# Altium project 2_Smoke_detector.PrjPcb (part 5 of 6)
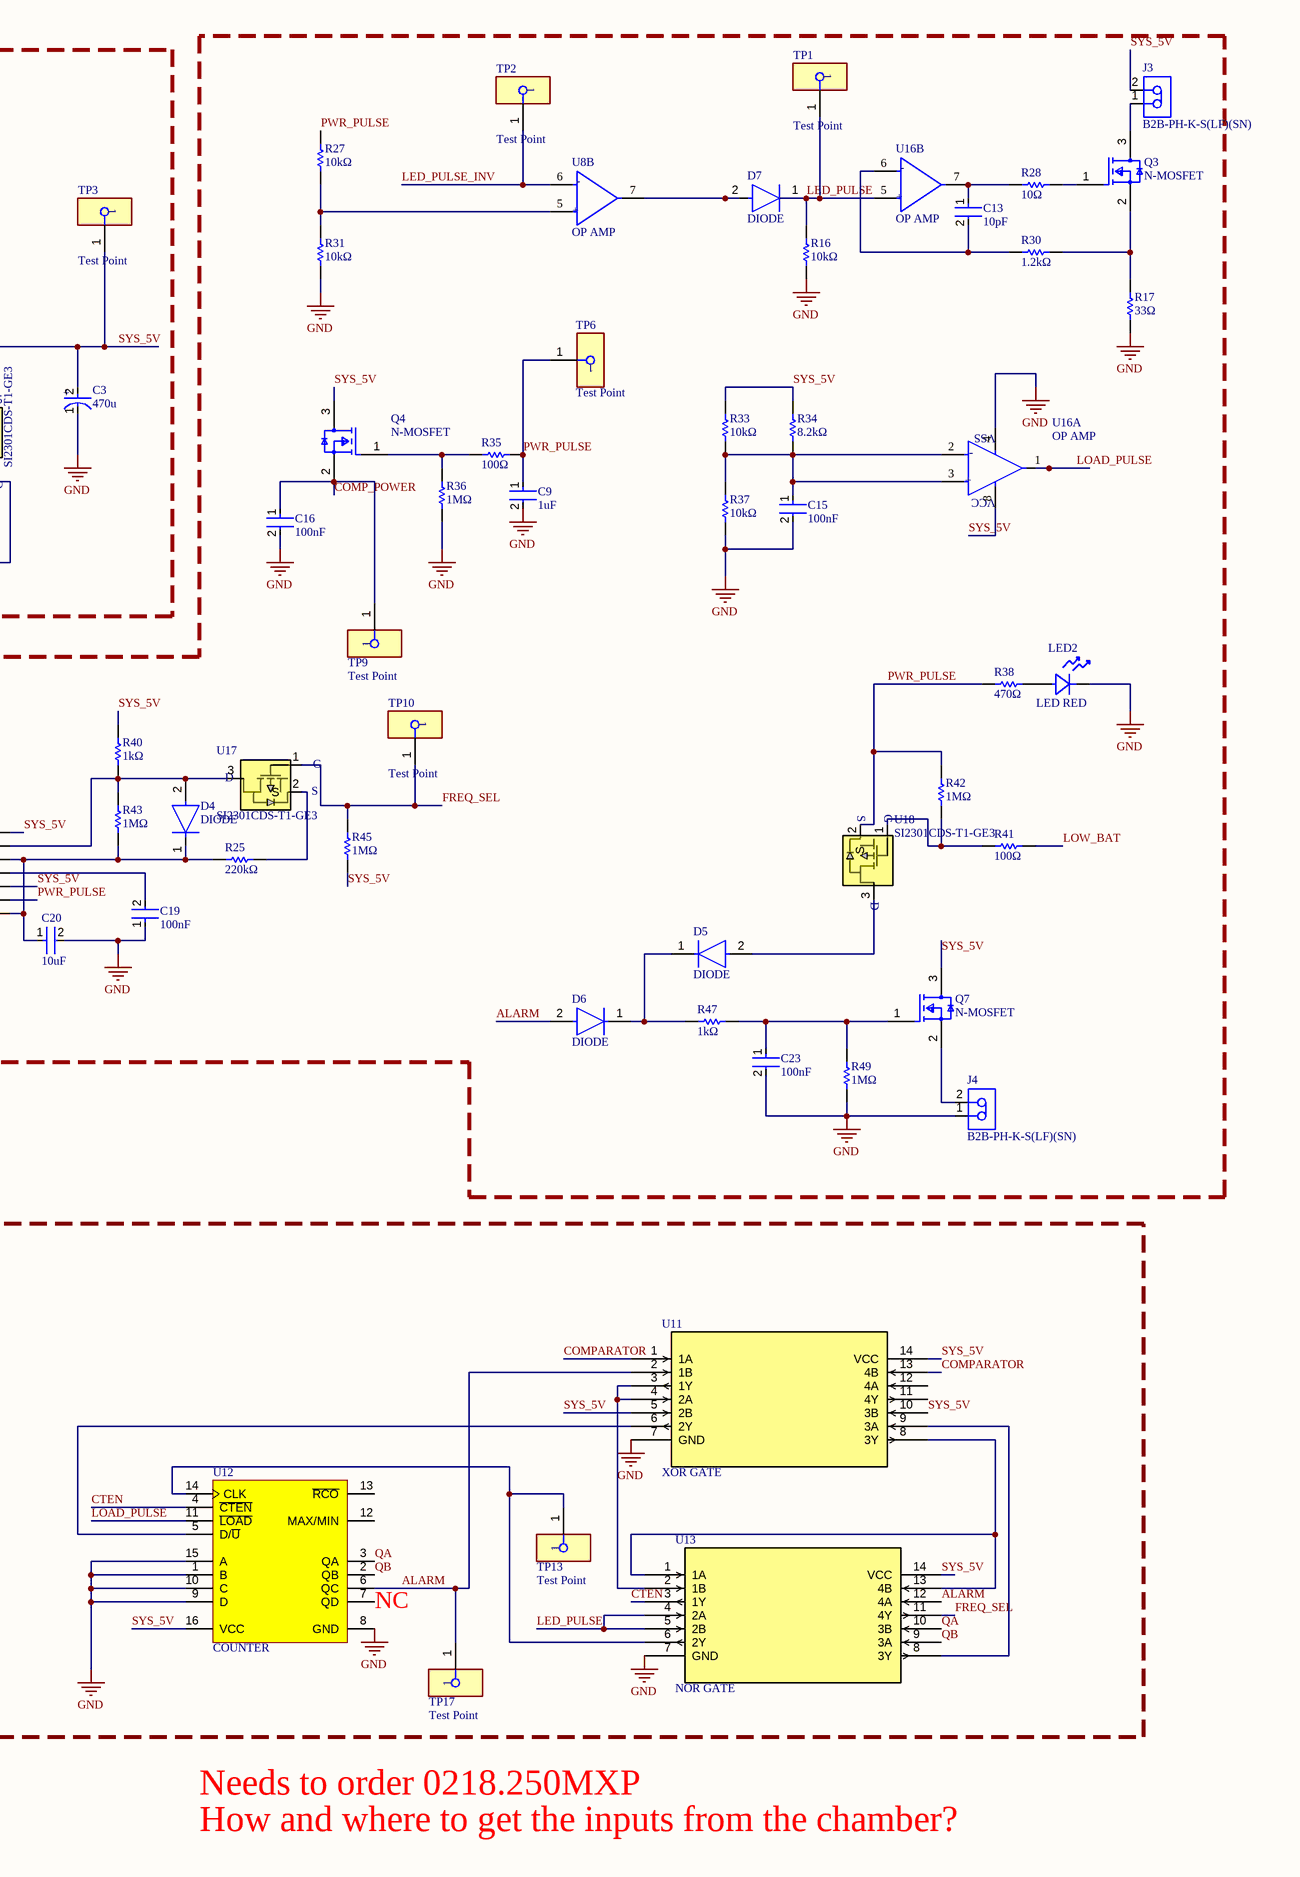
[diagram p5: 2_Smoke_detector.SchDoc, right]

## Sheet 2_Smoke_detector.SchDoc (continued)

### Library data of the parts (continued)
R23 R36 R42 R43 R45 R49 = RC0805FR-071ML: RES 1MΩ ±1% 125mW 0805; Manufacturer: Yageo Group; Temperature Coefficient: 100ppm/°C; Voltage Rating: 150V; Supplier: Future Electronics; Supplier Part Number: RC0805FR-071ML; Manufacturer Part Number: RC0805FR-071ML; RoHS: Compliant; Category: Chip SMD Resistors; Stock: 645000; Pricing: 5000=0.0068, 20000=0.0065, 75000=0.0063, 150000=0.0062, 375000=0.006 (USD); Case/Package: 0805; Case Code (Imperial): 0805; China RoHS: Non-Compliant; Composition: Thick Film; Contact Plating: Tin; Country of Origin: Mainland China, Taiwan; Depth: 1.25mm; Export Control Classification Number (ECCN) Code: EAR99; Features: Moisture Resistant; Height: 500µm; Harmonized Tariff Schedule (HTS) Code: 8533.21.00.30; Introduction Date: 2004-09-22; Lead Free: Lead Free; Length: 2mm; Lifecycle Status: Production; Max Operating Temperature: 155°C; Max Power Dissipation: 125mW; Military Standard: Not; Min Operating Temperature: -55°C; Mounting Technology: Surface Mount; Pins: 2; Number of Terminals: 2; Number of Terminations: 2; Packaging: Tape & Reel; Power Rating: 125mW; Radiation Hardening: No; REACH SVHC: Unaffected; Value: 1MΩ; Schedule B: 8533210045, 8533210045|8533210045, 8533210045|8533210045|8533210045, 8533210045|8533210045|8533210045|8533210045; Termination: SMD/SMT; Tolerance: 1%; Voltage Rating (AC): 150V; Voltage Rating (DC): 150V; Width: 1.25mm; Working Voltage: 150V; ComponentLink1URL: https://datasheet.octopart.com:443/RC0805FR-071ML-Yageo-datasheet-175887523.pdf?src-supplier=IHS; ComponentLink1Description: https://datasheet.octopart.com:443/RC0805FR-071ML-Yageo-datasheet-175887523.pdf?src-supplier=IHS; ComponentLink2URL: https://datasheet.octopart.com:443/RC0805FR-071ML-Yageo-datasheet-103092701.pdf?src-supplier=Upverter; ComponentLink2Description: https://datasheet.octopart.com:443/RC0805FR-071ML-Yageo-datasheet-103092701.pdf?src-supplier=Upverter; ComponentLink3URL: https://datasheet.octopart.com:443/RC0805FR-071ML-Yageo-datasheet-79472498.pdf?src-supplier=Upverter; ComponentLink3Description: https://datasheet.octopart.com:443/RC0805FR-071ML-Yageo-datasheet-79472498.pdf?src-supplier=Upverter; ComponentLink4URL: https://datasheet.octopart.com:443/RC0805FR-071ML-Yageo-datasheet-8330313.pdf?src-supplier=element14+APAC; ComponentLink4Description: https://datasheet.octopart.com:443/RC0805FR-071ML-Yageo-datasheet-8330313.pdf?src-supplier=element14+APAC; ComponentLink5URL: https://datasheet.octopart.com:443/RC0805FR-071ML-Yageo-Group-datasheet-190305687.pdf?src-supplier=Future+Electronics; ComponentLink5Description: https://datasheet.octopart.com:443/RC0805FR-071ML-Yageo-Group-datasheet-190305687.pdf?src-supplier=Future+Electronics; ComponentLink6URL: https://datasheet.octopart.com:443/RC0805FR-071ML-Yageo-datasheet-164759695.pdf?src-supplier=Future+Electronics; ComponentLink6Description: https://datasheet.octopart.com:443/RC0805FR-071ML-Yageo-datasheet-164759695.pdf?src-supplier=Future+Electronics; ComponentLink7URL: https://datasheet.octopart.com:443/RC0805FR-071ML-Yageo-datasheet-127823281.pdf?src-supplier=Future+Electronics; ComponentLink7Description: https://datasheet.octopart.com:443/RC0805FR-071ML-Yageo-datasheet-127823281.pdf?src-supplier=Future+Electronics; ComponentLink8URL: https://datasheet.octopart.com:443/RC0805FR-071ML-Yageo-datasheet-137700087.pdf?src-supplier=Future+Electronics; ComponentLink8Description: https://datasheet.octopart.com:443/RC0805FR-071ML-Yageo-datasheet-137700087.pdf?src-supplier=Future+Electronics; ComponentLink9URL: https://datasheet.octopart.com:443/RC0805FR-071ML-Yageo-datasheet-12592811.pdf?src-supplier=Future+Electronics; ComponentLink9Description: https://datasheet.octopart.com:443/RC0805FR-071ML-Yageo-datasheet-12592811.pdf?src-supplier=Future+Electronics; ComponentLink10URL: https://datasheet.octopart.com:443/RC0805FR-071ML-Yageo-datasheet-8324252.pdf?src-supplier=Future+Electronics; ComponentLink10Description: https://datasheet.octopart.com:443/RC0805FR-071ML-Yageo-datasheet-8324252.pdf?src-supplier=Future+Electronics; ComponentLink11URL: https://datasheet.octopart.com:443/RC0805FR-071ML-Yageo-datasheet-62067350.pdf?src-supplier=Farnell; ComponentLink11Description: https://datasheet.octopart.com:443/RC0805FR-071ML-Yageo-datasheet-62067350.pdf?src-supplier=Farnell; ComponentLink12URL: https://datasheet.octopart.com:443/RC0805FR-071ML-Yageo-datasheet-13691069.pdf?src-supplier=Farnell; ComponentLink12Description: https://datasheet.octopart.com:443/RC0805FR-071ML-Yageo-datasheet-13691069.pdf?src-supplier=Farnell; ComponentLink13URL: https://datasheet.octopart.com/RC0805FR-071ML-Yageo-datasheet-73766026.pdf; ComponentLink13Description: https://datasheet.octopart.com/RC0805FR-071ML-Yageo-datasheet-73766026.pdf; ComponentLink14URL: https://datasheet.octopart.com:443/RC0805FR-071ML-Yageo-datasheet-118657.pdf?src-supplier=DigiKey; ComponentLink14Description: https://datasheet.octopart.com:443/RC0805FR-071ML-Yageo-datasheet-118657.pdf?src-supplier=DigiKey; ComponentLink15URL: https://datasheet.octopart.com:443/RC0805FR-071ML-Yageo-datasheet-502840.pdf?src-supplier=element14; ComponentLink15Description: https://datasheet.octopart.com:443/RC0805FR-071ML-Yageo-datasheet-502840.pdf?src-supplier=element14; ComponentLink16URL: http://sigma.octopart.com:80/conflict_mineral_statement/Yageo-company-3.pdf?src-supplier=Compliance+Statements; ComponentLink16Description: http://sigma.octopart.com:80/conflict_mineral_statement/Yageo-company-3.pdf?src-supplier=Compliance+Statements; ComponentLink17URL: http://sigma.octopart.com:80/rohs_statement/Yageo-company-2.pdf?src-supplier=Compliance+Statements; ComponentLink17Description: http://sigma.octopart.com:80/rohs_statement/Yageo-company-2.pdf?src-supplier=Compliance+Statements; LCSC: C107700; LCSC Part Number: C107700
R25 = FRC0805F2203TS: RES 220kΩ ±1% 125mW 0805; LCSC Part Number: C2907242; Value: 220kΩ
R26 = CRCW080522K0FKEAC: RES 22kΩ 1% 1/8W 0805; Manufacturer: Vishay; Power Rating: 125mW; Temperature Coefficient: 100ppm/°C; Working Voltage: 150V; Supplier: Avnet; Supplier Part Number: CRCW080522K0FKEAC; Manufacturer Part Number: CRCW080522K0FKEAC; RoHS: Compliant; Category: Chip SMD Resistors; Stock: 85000; Pricing: 5000=0.00893, 100000=0.00478, 200000=0.00475, 400000=0.00473, 800000=0.0047 (USD); Case/Package: 0805; China RoHS: Non-Compliant; Composition: Thick Film; Contact Plating: Tin; Height: 500µm; Lead Free: Lead Free; Length: 2mm; Lifecycle Status: Production; Max Operating Temperature: 155°C; Min Operating Temperature: -55°C; Mounting Technology: Surface Mount; Number of Terminals: 2; REACH SVHC: Unaffected; Value: 22kΩ; Schedule B: 8533210045, 8533210045|8533210045|8533210045|8533210045|8533210045; Termination: Wraparound; Tolerance: 1%; Width: 1.25mm; ComponentLink1URL: https://datasheet.octopart.com:443/CRCW080522K0FKEAC-Vishay-datasheet-175423585.pdf?src-supplier=IHS; ComponentLink1Description: https://datasheet.octopart.com:443/CRCW080522K0FKEAC-Vishay-datasheet-175423585.pdf?src-supplier=IHS; ComponentLink2URL: https://datasheet.octopart.com:443/CRCW080522K0FKEAC-Vishay-datasheet-102570912.pdf?src-supplier=LCSC; ComponentLink2Description: https://datasheet.octopart.com:443/CRCW080522K0FKEAC-Vishay-datasheet-102570912.pdf?src-supplier=LCSC; ComponentLink3URL: https://datasheet.octopart.com:443/CRCW080522K0FKEAC-Vishay-datasheet-62316122.pdf?src-supplier=Future+Electronics; ComponentLink3Description: https://datasheet.octopart.com:443/CRCW080522K0FKEAC-Vishay-datasheet-62316122.pdf?src-supplier=Future+Electronics; ComponentLink4URL: http://sigma.octopart.com:80/rohs_statement/Vishay-company-15.pdf?src-supplier=Compliance+Statements; ComponentLink4Description: http://sigma.octopart.com:80/rohs_statement/Vishay-company-15.pdf?src-supplier=Compliance+Statements; LCSC Part Number: C844401
R28 = CRCW080510R0FKEA: RES 10Ω ±1% 125mW 0805; Manufacturer: Vishay; Manufacturer Package Identifier: CRCW0805-e3; Temperature Coefficient: 100ppm/°C; Voltage Rating: 150V; Supplier: Future Electronics; Supplier Part Number: CRCW080510R0FKEA; Manufacturer Part Number: CRCW080510R0FKEA; RoHS: Compliant; Category: Chip SMD Resistors; Stock: 2860000; Pricing: 10000=0.0023, 50000=0.0022, 125000=0.0022, 375000=0.0021, 750000=0.002 (USD); Case/Package: 0805; Case Code (Imperial): 0805; China RoHS: Non-Compliant; Composition: Thick Film; Contact Plating: Lead, Tin; Country of Origin: Israel; Depth: 1.25mm; Export Control Classification Number (ECCN) Code: EAR99; Features: Automotive AEC-Q200; Height: 450µm; Harmonized Tariff Schedule (HTS) Code: 8533.21.00.30; Introduction Date: 2005-02-16; Lead Free: Lead Free; Length: 2mm; Lifecycle Status: Production; Max Operating Temperature: 155°C; Max Power Dissipation: 125mW; Military Standard: Not; Min Operating Temperature: -55°C; Mounting Technology: Surface Mount; Pins: 2; Number of Terminals: 2; Number of Terminations: 2; Packaging: Cut Tape; Power Rating: 125mW; Radiation Hardening: No; Ratings: AEC-Q200; REACH SVHC: Unaffected; Value: 10Ω; Schedule B: 8533210045, 8533210045|8533210045|8533210045|8533210045|8533210045|8533210045|8533210045|8533210045|8533210045|8533210045|8533210045|8533210045|8533210045|8533210045|8533210045|8533210045|8533210045|8533210045|8533210045|8533210045|8533210045|8533210045|8533210045|85; Termination: SMD/SMT; Tolerance: 1%; Voltage Rating (DC): 150V; Weight: 5.499807mg; Width: 1.25mm; Working Voltage: 150V; ComponentLink1URL: https://datasheet.octopart.com:443/CRCW080510R0FKEA-Vishay-datasheet-175423584.pdf?src-supplier=IHS; ComponentLink1Description: https://datasheet.octopart.com:443/CRCW080510R0FKEA-Vishay-datasheet-175423584.pdf?src-supplier=IHS; ComponentLink2URL: https://datasheet.octopart.com:443/CRCW080510R0FKEA-Vishay-datasheet-83961561.pdf?src-supplier=Newark; ComponentLink2Description: https://datasheet.octopart.com:443/CRCW080510R0FKEA-Vishay-datasheet-83961561.pdf?src-supplier=Newark; ComponentLink3URL: https://datasheet.octopart.com:443/CRCW080510R0FKEA-Vishay-datasheet-11516975.pdf?src-supplier=Newark; ComponentLink3Description: https://datasheet.octopart.com:443/CRCW080510R0FKEA-Vishay-datasheet-11516975.pdf?src-supplier=Newark; ComponentLink4URL: https://datasheet.octopart.com:443/CRCW080510R0FKEA-Vishay-datasheet-41302739.pdf?src-supplier=Newark; ComponentLink4Description: https://datasheet.octopart.com:443/CRCW080510R0FKEA-Vishay-datasheet-41302739.pdf?src-supplier=Newark; ComponentLink5URL: https://datasheet.octopart.com:443/CRCW080510R0FKEA-Vishay-datasheet-33013972.pdf?src-supplier=Newark; ComponentLink5Description: https://datasheet.octopart.com:443/CRCW080510R0FKEA-Vishay-datasheet-33013972.pdf?src-supplier=Newark; ComponentLink6URL: https://datasheet.octopart.com:443/CRCW080510R0FKEA-Vishay-datasheet-62317937.pdf?src-supplier=element14+APAC; ComponentLink6Description: https://datasheet.octopart.com:443/CRCW080510R0FKEA-Vishay-datasheet-62317937.pdf?src-supplier=element14+APAC; ComponentLink7URL: https://datasheet.octopart.com:443/CRCW080510R0FKEA-Vishay-datasheet-14722531.pdf?src-supplier=element14+APAC; ComponentLink7Description: https://datasheet.octopart.com:443/CRCW080510R0FKEA-Vishay-datasheet-14722531.pdf?src-supplier=element14+APAC; ComponentLink8URL: https://datasheet.octopart.com:443/CRCW080510R0FKEA.-Vishay-datasheet-78776209.pdf?src-supplier=element14+APAC; ComponentLink8Description: https://datasheet.octopart.com:443/CRCW080510R0FKEA.-Vishay-datasheet-78776209.pdf?src-supplier=element14+APAC; ComponentLink9URL: https://datasheet.octopart.com:443/CRCW080510R0FKEA-Vishay-datasheet-66077789.pdf?src-supplier=element14+APAC; ComponentLink9Description: https://datasheet.octopart.com:443/CRCW080510R0FKEA-Vishay-datasheet-66077789.pdf?src-supplier=element14+APAC; ComponentLink10URL: https://datasheet.octopart.com:443/CRCW080510R0FKEA-Vishay-datasheet-16179825.pdf?src-supplier=element14+APAC; ComponentLink10Description: https://datasheet.octopart.com:443/CRCW080510R0FKEA-Vishay-datasheet-16179825.pdf?src-supplier=element14+APAC; ComponentLink11URL: https://datasheet.octopart.com:443/CRCW080510R0FKEA-Vishay-datasheet-5306405.pdf?src-supplier=Future+Electronics; ComponentLink11Description: https://datasheet.octopart.com:443/CRCW080510R0FKEA-Vishay-datasheet-5306405.pdf?src-supplier=Future+Electronics; ComponentLink12URL: https://datasheet.octopart.com:443/CRCW080510R0FKEA-Vishay-datasheet-13242068.pdf?src-supplier=Future+Electronics; ComponentLink12Description: https://datasheet.octopart.com:443/CRCW080510R0FKEA-Vishay-datasheet-13242068.pdf?src-supplier=Future+Electronics; ComponentLink13URL: https://datasheet.octopart.com:443/CRCW080510R0FKEA-Vishay-datasheet-13195083.pdf?src-supplier=Future+Electronics; ComponentLink13Description: https://datasheet.octopart.com:443/CRCW080510R0FKEA-Vishay-datasheet-13195083.pdf?src-supplier=Future+Electronics; ComponentLink14URL: https://datasheet.octopart.com:443/CRCW080510R0FKEA-Vishay-datasheet-13034211.pdf?src-supplier=Future+Electronics; ComponentLink14Description: https://datasheet.octopart.com:443/CRCW080510R0FKEA-Vishay-datasheet-13034211.pdf?src-supplier=Future+Electronics; ComponentLink15URL: https://datasheet.octopart.com:443/CRCW080510R0FKEA-Vishay-datasheet-12600034.pdf?src-supplier=Future+Electronics; ComponentLink15Description: https://datasheet.octopart.com:443/CRCW080510R0FKEA-Vishay-datasheet-12600034.pdf?src-supplier=Future+Electronics; ComponentLink16URL: https://datasheet.octopart.com:443/CRCW080510R0FKEA-Vishay-datasheet-12532161.pdf?src-supplier=Future+Electronics; ComponentLink16Description: https://datasheet.octopart.com:443/CRCW080510R0FKEA-Vishay-datasheet-12532161.pdf?src-supplier=Future+Electronics; ComponentLink17URL: https://datasheet.octopart.com:443/CRCW080510R0FKEA-Vishay-datasheet-12509762.pdf?src-supplier=Future+Electronics; ComponentLink17Description: https://datasheet.octopart.com:443/CRCW080510R0FKEA-Vishay-datasheet-12509762.pdf?src-supplier=Future+Electronics; ComponentLink18URL: https://datasheet.octopart.com:443/CRCW080510R0FKEA-Vishay-datasheet-10322335.pdf?src-supplier=Future+Electronics; ComponentLink18Description: https://datasheet.octopart.com:443/CRCW080510R0FKEA-Vishay-datasheet-10322335.pdf?src-supplier=Future+Electronics; ComponentLink19URL: https://datasheet.octopart.com:443/CRCW080510R0FKEA-Vishay-datasheet-8788789.pdf?src-supplier=Future+Electronics; ComponentLink19Description: https://datasheet.octopart.com:443/CRCW080510R0FKEA-Vishay-datasheet-8788789.pdf?src-supplier=Future+Electronics; ComponentLink20URL: https://datasheet.octopart.com:443/CRCW080510R0FKEA-Vishay-datasheet-8361388.pdf?src-supplier=Future+Electronics; ComponentLink20Description: https://datasheet.octopart.com:443/CRCW080510R0FKEA-Vishay-datasheet-8361388.pdf?src-supplier=Future+Electronics; ComponentLink21URL: https://datasheet.octopart.com:443/CRCW080510R0FKEA-Vishay-datasheet-5300368.pdf?src-supplier=Future+Electronics; ComponentLink21Description: https://datasheet.octopart.com:443/CRCW080510R0FKEA-Vishay-datasheet-5300368.pdf?src-supplier=Future+Electronics; ComponentLink22URL: https://datasheet.octopart.com:443/CRCW080510R0FKEA-Vishay-datasheet-546287.pdf?src-supplier=Future+Electronics; ComponentLink22Description: https://datasheet.octopart.com:443/CRCW080510R0FKEA-Vishay-datasheet-546287.pdf?src-supplier=Future+Electronics; ComponentLink23URL: https://datasheet.octopart.com:443/CRCW080510R0FKEA-Vishay-datasheet-62316122.pdf?src-supplier=Future+Electronics; ComponentLink23Description: https://datasheet.octopart.com:443/CRCW080510R0FKEA-Vishay-datasheet-62316122.pdf?src-supplier=Future+Electronics; ComponentLink24URL: https://datasheet.octopart.com:443/CRCW080510R0FKEA-Vishay-datasheet-12517896.pdf?src-supplier=Farnell; ComponentLink24Description: https://datasheet.octopart.com:443/CRCW080510R0FKEA-Vishay-datasheet-12517896.pdf?src-supplier=Farnell; ComponentLink25URL: https://datasheet.octopart.com:443/CRCW080510R0FKEA-Vishay-datasheet-149165818.pdf?src-supplier=HQonline; ComponentLink25Description: https://datasheet.octopart.com:443/CRCW080510R0FKEA-Vishay-datasheet-149165818.pdf?src-supplier=HQonline; ComponentLink26URL: https://datasheet.octopart.com:443/CRCW080510R0FKEA-Vishay-Dale-datasheet-47688880.pdf?src-supplier=RS+(Formerly+Allied+Electronics); ComponentLink26Description: https://datasheet.octopart.com:443/CRCW080510R0FKEA-Vishay-Dale-datasheet-47688880.pdf?src-supplier=RS+(Formerly+Allied+Electronics); ComponentLink27URL: https://datasheet.octopart.com:443/CRCW080510R0FKEA-Vishay-datasheet-12001583.pdf?src-supplier=RS+(Formerly+Allied+Electronics); ComponentLink27Description: https://datasheet.octopart.com:443/CRCW080510R0FKEA-Vishay-datasheet-12001583.pdf?src-supplier=RS+(Formerly+Allied+Electronics); ComponentLink28URL: https://datasheet.octopart.com:443/CRCW080510R0FKEA-Vishay-datasheet-17834126.pdf?src-supplier=TME; ComponentLink28Description: https://datasheet.octopart.com:443/CRCW080510R0FKEA-Vishay-datasheet-17834126.pdf?src-supplier=TME; ComponentLink29URL: https://datasheet.octopart.com:443/CRCW080510R0FKEA-Vishay-datasheet-8445837.pdf?src-supplier=element14; ComponentLink29Description: https://datasheet.octopart.com:443/CRCW080510R0FKEA-Vishay-datasheet-8445837.pdf?src-supplier=element14; ComponentLink30URL: https://datasheet.octopart.com:443/CRCW080510R0FKEA-Vishay-datasheet-5377306.pdf?src-supplier=Garrett; ComponentLink30Description: https://datasheet.octopart.com:443/CRCW080510R0FKEA-Vishay-datasheet-5377306.pdf?src-supplier=Garrett; ComponentLink31URL: https://datasheet.octopart.com:443/CRCW080510R0FKEA-Vishay-datasheet-148188.pdf?src-supplier=Garrett; ComponentLink31Description: https://datasheet.octopart.com:443/CRCW080510R0FKEA-Vishay-datasheet-148188.pdf?src-supplier=Garrett; ComponentLink32URL: https://datasheet.octopart.com:443/CRCW080510R0FKEA-Vishay-datasheet-34203.pdf?src-supplier=Garrett; ComponentLink32Description: https://datasheet.octopart.com:443/CRCW080510R0FKEA-Vishay-datasheet-34203.pdf?src-supplier=Garrett; ComponentLink33URL: http://sigma.octopart.com:80/rohs_statement/Vishay-company-15.pdf?src-supplier=Compliance+Statements; ComponentLink33Description: http://sigma.octopart.com:80/rohs_statement/Vishay-company-15.pdf?src-supplier=Compliance+Statements; LCSC Part Number: C844938
R29 R30 = FRC0805J122 TS: RES 1.2kΩ ±5% 125mW 0805; Value: 1.2kΩ; LCSC Part Number: C2933520
R32 = 3224W1103E: TRIMMER 10K OHM 0.25W J LEAD TOP; MF: Bourns Electronics; SnapEDA_Link: https://www.snapeda.com/parts/3224W1103E/Bourns/view-part/?ref=snap; Package: 3224W-1 Bourns; Value: *; MP: 3224W1103E; Check_prices: https://www.snapeda.com/parts/3224W1103E/Bourns/view-part/?ref=eda; LCSC Part Number: C81348
R34 = CRCW08058K20FKEA: RES 8.2kΩ ±1% 125mW 0805; Manufacturer: Vishay; Manufacturer Package Identifier: CRCW0805-e3; Temperature Coefficient: 100ppm/°C; Voltage Rating: 150V; Supplier: Future Electronics; Supplier Part Number: CRCW08058K20FKEA; Manufacturer Part Number: CRCW08058K20FKEA; RoHS: Compliant; Category: Chip SMD Resistors; Stock: 90000; Pricing: 5000=0.0094, 20000=0.009, 50000=0.0088, 125000=0.0086, 200000=0.0083 (USD); Case/Package: 0805; Case Code (Imperial): 0805; China RoHS: Non-Compliant; Composition: Thick Film; Contact Plating: Tin; Depth: 1.25mm; Height: 450µm; Lead Free: Lead Free; Length: 2mm; Lifecycle Status: Production; Max Operating Temperature: 155°C; Military Standard: Not; Min Operating Temperature: -55°C; Mounting Technology: Surface Mount; Pins: 2; Number of Terminals: 2; Packaging: Cut Tape; Power Rating: 125mW; Radiation Hardening: No; Ratings: AEC-Q200; REACH SVHC: Unaffected; Value: 8.2kΩ; Schedule B: 8533210045, 8533210045|8533210045, 8533210045|8533210045|8533210045, 8533210045|8533210045|8533210045|8533210045; Termination: SMD/SMT; Tolerance: 1%; Voltage Rating (DC): 150V; Weight: 5.499807mg; Width: 1.25mm; Working Voltage: 150V; ComponentLink1URL: https://datasheet.octopart.com:443/CRCW08058K20FKEA-Vishay-datasheet-175423584.pdf?src-supplier=IHS; ComponentLink1Description: https://datasheet.octopart.com:443/CRCW08058K20FKEA-Vishay-datasheet-175423584.pdf?src-supplier=IHS; ComponentLink2URL: https://datasheet.octopart.com:443/CRCW08058K20FKEA-Vishay-datasheet-83961561.pdf?src-supplier=element14+APAC; ComponentLink2Description: https://datasheet.octopart.com:443/CRCW08058K20FKEA-Vishay-datasheet-83961561.pdf?src-supplier=element14+APAC; ComponentLink3URL: https://datasheet.octopart.com:443/CRCW08058K20FKEA-Vishay-datasheet-62317937.pdf?src-supplier=element14+APAC; ComponentLink3Description: https://datasheet.octopart.com:443/CRCW08058K20FKEA-Vishay-datasheet-62317937.pdf?src-supplier=element14+APAC; ComponentLink4URL: https://datasheet.octopart.com:443/CRCW08058K20FKEA-Vishay-datasheet-14722531.pdf?src-supplier=element14+APAC; ComponentLink4Description: https://datasheet.octopart.com:443/CRCW08058K20FKEA-Vishay-datasheet-14722531.pdf?src-supplier=element14+APAC; ComponentLink5URL: https://datasheet.octopart.com:443/CRCW08058K20FKEA.-Vishay-datasheet-78776209.pdf?src-supplier=element14+APAC; ComponentLink5Description: https://datasheet.octopart.com:443/CRCW08058K20FKEA.-Vishay-datasheet-78776209.pdf?src-supplier=element14+APAC; ComponentLink6URL: https://datasheet.octopart.com:443/CRCW08058K20FKEA-Vishay-datasheet-66077789.pdf?src-supplier=element14+APAC; ComponentLink6Description: https://datasheet.octopart.com:443/CRCW08058K20FKEA-Vishay-datasheet-66077789.pdf?src-supplier=element14+APAC; ComponentLink7URL: https://datasheet.octopart.com:443/CRCW08058K20FKEA-Vishay-datasheet-31669108.pdf?src-supplier=Farnell; ComponentLink7Description: https://datasheet.octopart.com:443/CRCW08058K20FKEA-Vishay-datasheet-31669108.pdf?src-supplier=Farnell; ComponentLink8URL: https://datasheet.octopart.com:443/CRCW08058K20FKEA-Vishay-datasheet-13242068.pdf?src-supplier=Farnell; ComponentLink8Description: https://datasheet.octopart.com:443/CRCW08058K20FKEA-Vishay-datasheet-13242068.pdf?src-supplier=Farnell; ComponentLink9URL: https://datasheet.octopart.com:443/CRCW08058K20FKEA-Vishay-datasheet-13195083.pdf?src-supplier=Farnell; ComponentLink9Description: https://datasheet.octopart.com:443/CRCW08058K20FKEA-Vishay-datasheet-13195083.pdf?src-supplier=Farnell; ComponentLink10URL: https://datasheet.octopart.com:443/CRCW08058K20FKEA-Vishay-datasheet-13034211.pdf?src-supplier=Farnell; ComponentLink10Description: https://datasheet.octopart.com:443/CRCW08058K20FKEA-Vishay-datasheet-13034211.pdf?src-supplier=Farnell; ComponentLink11URL: https://datasheet.octopart.com:443/CRCW08058K20FKEA-Vishay-datasheet-12600034.pdf?src-supplier=Farnell; ComponentLink11Description: https://datasheet.octopart.com:443/CRCW08058K20FKEA-Vishay-datasheet-12600034.pdf?src-supplier=Farnell; ComponentLink12URL: https://datasheet.octopart.com:443/CRCW08058K20FKEA-Vishay-datasheet-12532161.pdf?src-supplier=Farnell; ComponentLink12Description: https://datasheet.octopart.com:443/CRCW08058K20FKEA-Vishay-datasheet-12532161.pdf?src-supplier=Farnell; ComponentLink13URL: https://datasheet.octopart.com:443/CRCW08058K20FKEA-Vishay-datasheet-12517896.pdf?src-supplier=Farnell; ComponentLink13Description: https://datasheet.octopart.com:443/CRCW08058K20FKEA-Vishay-datasheet-12517896.pdf?src-supplier=Farnell; ComponentLink14URL: https://datasheet.octopart.com:443/CRCW08058K20FKEA-Vishay-datasheet-12509762.pdf?src-supplier=Farnell; ComponentLink14Description: https://datasheet.octopart.com:443/CRCW08058K20FKEA-Vishay-datasheet-12509762.pdf?src-supplier=Farnell; ComponentLink15URL: https://datasheet.octopart.com:443/CRCW08058K20FKEA-Vishay-datasheet-10322335.pdf?src-supplier=Farnell; ComponentLink15Description: https://datasheet.octopart.com:443/CRCW08058K20FKEA-Vishay-datasheet-10322335.pdf?src-supplier=Farnell; ComponentLink16URL: https://datasheet.octopart.com:443/CRCW08058K20FKEA-Vishay-datasheet-8788789.pdf?src-supplier=Farnell; ComponentLink16Description: https://datasheet.octopart.com:443/CRCW08058K20FKEA-Vishay-datasheet-8788789.pdf?src-supplier=Farnell; ComponentLink17URL: https://datasheet.octopart.com:443/CRCW08058K20FKEA-Vishay-datasheet-8361388.pdf?src-supplier=Farnell; ComponentLink17Description: https://datasheet.octopart.com:443/CRCW08058K20FKEA-Vishay-datasheet-8361388.pdf?src-supplier=Farnell; ComponentLink18URL: https://datasheet.octopart.com:443/CRCW08058K20FKEA-Vishay-datasheet-546287.pdf?src-supplier=Farnell; ComponentLink18Description: https://datasheet.octopart.com:443/CRCW08058K20FKEA-Vishay-datasheet-546287.pdf?src-supplier=Farnell; ComponentLink19URL: https://datasheet.octopart.com:443/CRCW08058K20FKEA-Vishay-datasheet-11516975.pdf?src-supplier=Newark; ComponentLink19Description: https://datasheet.octopart.com:443/CRCW08058K20FKEA-Vishay-datasheet-11516975.pdf?src-supplier=Newark; ComponentLink20URL: https://datasheet.octopart.com:443/CRCW08058K20FKEA-Vishay-datasheet-41302739.pdf?src-supplier=Newark; ComponentLink20Description: https://datasheet.octopart.com:443/CRCW08058K20FKEA-Vishay-datasheet-41302739.pdf?src-supplier=Newark; ComponentLink21URL: https://datasheet.octopart.com:443/CRCW08058K20FKEA-Vishay-datasheet-33013972.pdf?src-supplier=Newark; ComponentLink21Description: https://datasheet.octopart.com:443/CRCW08058K20FKEA-Vishay-datasheet-33013972.pdf?src-supplier=Newark; ComponentLink22URL: https://datasheet.octopart.com:443/CRCW08058K20FKEA-Vishay-datasheet-5300368.pdf?src-supplier=Future+Electronics; ComponentLink22Description: https://datasheet.octopart.com:443/CRCW08058K20FKEA-Vishay-datasheet-5300368.pdf?src-supplier=Future+Electronics; ComponentLink23URL: https://datasheet.octopart.com:443/CRCW08058K20FKEA-Vishay-datasheet-62316122.pdf?src-supplier=Future+Electronics; ComponentLink23Description: https://datasheet.octopart.com:443/CRCW08058K20FKEA-Vishay-datasheet-62316122.pdf?src-supplier=Future+Electronics; ComponentLink24URL: https://datasheet.octopart.com:443/CRCW08058K20FKEA-Vishay-datasheet-5306405.pdf?src-supplier=RS+(Formerly+Allied+Electronics); ComponentLink24Description: https://datasheet.octopart.com:443/CRCW08058K20FKEA-Vishay-datasheet-5306405.pdf?src-supplier=RS+(Formerly+Allied+Electronics); ComponentLink25URL: https://datasheet.octopart.com:443/CRCW08058K20FKEA-Vishay-Dale-datasheet-47688880.pdf?src-supplier=RS+(Formerly+Allied+Electronics); ComponentLink25Description: https://datasheet.octopart.com:443/CRCW08058K20FKEA-Vishay-Dale-datasheet-47688880.pdf?src-supplier=RS+(Formerly+Allied+Electronics); ComponentLink26URL: https://datasheet.octopart.com:443/CRCW08058K20FKEA-Vishay-datasheet-12001583.pdf?src-supplier=RS+(Formerly+Allied+Electronics); ComponentLink26Description: https://datasheet.octopart.com:443/CRCW08058K20FKEA-Vishay-datasheet-12001583.pdf?src-supplier=RS+(Formerly+Allied+Electronics); ComponentLink27URL: https://datasheet.octopart.com:443/CRCW08058K20FKEA-Vishay-datasheet-190005712.pdf?src-supplier=TME; ComponentLink27Description: https://datasheet.octopart.com:443/CRCW08058K20FKEA-Vishay-datasheet-190005712.pdf?src-supplier=TME; ComponentLink28URL: https://datasheet.octopart.com:443/CRCW08058K20FKEA-Vishay-datasheet-11540273.pdf?src-supplier=Arrow+Electronics; ComponentLink28Description: https://datasheet.octopart.com:443/CRCW08058K20FKEA-Vishay-datasheet-11540273.pdf?src-supplier=Arrow+Electronics; ComponentLink29URL: https://datasheet.octopart.com:443/CRCW08058K20FKEA-Vishay-datasheet-8445837.pdf?src-supplier=element14; ComponentLink29Description: https://datasheet.octopart.com:443/CRCW08058K20FKEA-Vishay-datasheet-8445837.pdf?src-supplier=element14; ComponentLink30URL: http://sigma.octopart.com:80/rohs_statement/Vishay-company-15.pdf?src-supplier=Compliance+Statements; ComponentLink30Description: http://sigma.octopart.com:80/rohs_statement/Vishay-company-15.pdf?src-supplier=Compliance+Statements; LCSC Part Number: C844640
R38 = RC0805FR-07470RL: RES 470Ω 1% 1/8W 0805; Manufacturer: Yageo Group; Max Power Dissipation: 125mW; Temperature Coefficient: 100ppm/°C; Voltage Rating: 150V; Supplier: Future Electronics; Supplier Part Number: RC0805FR-07470RL; Manufacturer Part Number: RC0805FR-07470RL; RoHS: Compliant; Category: Chip SMD Resistors; Stock: 335000; Pricing: 5000=0.0068, 20000=0.0066, 75000=0.0064, 150000=0.0063, 375000=0.006 (USD); Case/Package: 0805; Case Code (Imperial): 0805; China RoHS: Non-Compliant; Composition: Thick Film; Contact Plating: Tin; Country of Origin: Mainland China, Taiwan; Depth: 1.25mm; Export Control Classification Number (ECCN) Code: EAR99; Features: Moisture Resistant; Height: 500µm; Harmonized Tariff Schedule (HTS) Code: 8533.21.00.30; Introduction Date: 2004-09-22; Lead Free: Lead Free; Lead Pitch: 400µm; Length: 2mm; Lifecycle Status: Production; Max Operating Temperature: 155°C; Military Standard: Not; Min Operating Temperature: -55°C; Mounting Technology: Surface Mount; Pins: 2; Number of Terminals: 2; Number of Terminations: 2; Packaging: Tape & Reel; Power Rating: 125mW; Radiation Hardening: No; REACH SVHC: Unaffected; Value: 470Ω; Schedule B: 8533210045, 8533210045|8533210045|8533210045|8533210045|8533210045|8533210045|8533210045|8533210045|8533210045|8533210045|8533210045|8533210045|8533210045|8533210045|8533210045|8533210045|8533210045|8533210045|8533210045|8533210045|8533210045|8533210045|8533210045|85; Termination: SMD/SMT; Tolerance: 1%; Voltage Rating (AC): 150V; Voltage Rating (DC): 150V; Width: 1.25mm; Working Voltage: 150V; ComponentLink1URL: https://datasheet.octopart.com:443/RC0805FR-07470RL-Yageo-datasheet-175887523.pdf?src-supplier=Newark; ComponentLink1Description: https://datasheet.octopart.com:443/RC0805FR-07470RL-Yageo-datasheet-175887523.pdf?src-supplier=Newark; ComponentLink2URL: https://datasheet.octopart.com:443/RC0805FR-07470RL-Yageo-Group-datasheet-190051977.pdf?src-supplier=Newark; ComponentLink2Description: https://datasheet.octopart.com:443/RC0805FR-07470RL-Yageo-Group-datasheet-190051977.pdf?src-supplier=Newark; ComponentLink3URL: https://datasheet.octopart.com:443/RC0805FR-07470RL-Yageo-datasheet-103092701.pdf?src-supplier=Upverter; ComponentLink3Description: https://datasheet.octopart.com:443/RC0805FR-07470RL-Yageo-datasheet-103092701.pdf?src-supplier=Upverter; ComponentLink4URL: https://datasheet.octopart.com:443/RC0805FR-07470RL-Yageo-datasheet-98239111.pdf?src-supplier=Upverter; ComponentLink4Description: https://datasheet.octopart.com:443/RC0805FR-07470RL-Yageo-datasheet-98239111.pdf?src-supplier=Upverter; ComponentLink5URL: https://datasheet.octopart.com:443/RC0805FR-07470RL-Yageo-datasheet-8330313.pdf?src-supplier=element14+APAC; ComponentLink5Description: https://datasheet.octopart.com:443/RC0805FR-07470RL-Yageo-datasheet-8330313.pdf?src-supplier=element14+APAC; ComponentLink6URL: https://datasheet.octopart.com:443/RC0805FR-07470RL-Yageo-datasheet-62067350.pdf?src-supplier=Farnell; ComponentLink6Description: https://datasheet.octopart.com:443/RC0805FR-07470RL-Yageo-datasheet-62067350.pdf?src-supplier=Farnell; ComponentLink7URL: https://datasheet.octopart.com:443/RC0805FR-07470RL-Yageo-datasheet-13691069.pdf?src-supplier=Farnell; ComponentLink7Description: https://datasheet.octopart.com:443/RC0805FR-07470RL-Yageo-datasheet-13691069.pdf?src-supplier=Farnell; ComponentLink8URL: https://datasheet.octopart.com:443/RC0805FR-07470RL-Yageo-Group-datasheet-176638170.pdf?src-supplier=Future+Electronics; ComponentLink8Description: https://datasheet.octopart.com:443/RC0805FR-07470RL-Yageo-Group-datasheet-176638170.pdf?src-supplier=Future+Electronics; ComponentLink9URL: https://datasheet.octopart.com:443/RC0805FR-07470RL-Yageo-datasheet-164759695.pdf?src-supplier=Future+Electronics; ComponentLink9Description: https://datasheet.octopart.com:443/RC0805FR-07470RL-Yageo-datasheet-164759695.pdf?src-supplier=Future+Electronics; ComponentLink10URL: https://datasheet.octopart.com:443/RC0805FR-07470RL-Yageo-datasheet-12592811.pdf?src-supplier=Future+Electronics; ComponentLink10Description: https://datasheet.octopart.com:443/RC0805FR-07470RL-Yageo-datasheet-12592811.pdf?src-supplier=Future+Electronics; ComponentLink11URL: https://datasheet.octopart.com:443/RC0805FR-07470RL-Yageo-datasheet-8324252.pdf?src-supplier=Future+Electronics; ComponentLink11Description: https://datasheet.octopart.com:443/RC0805FR-07470RL-Yageo-datasheet-8324252.pdf?src-supplier=Future+Electronics; ComponentLink12URL: https://datasheet.octopart.com:443/RC0805FR-07470RL-Yageo-datasheet-79472498.pdf?src-supplier=Megastar; ComponentLink12Description: https://datasheet.octopart.com:443/RC0805FR-07470RL-Yageo-datasheet-79472498.pdf?src-supplier=Megastar; ComponentLink13URL: https://datasheet.octopart.com/RC0805FR-07470RL-Yageo-datasheet-73766026.pdf; ComponentLink13Description: https://datasheet.octopart.com/RC0805FR-07470RL-Yageo-datasheet-73766026.pdf; ComponentLink14URL: https://datasheet.octopart.com:443/RC0805FR-07470RL-Yageo-datasheet-118657.pdf?src-supplier=DigiKey; ComponentLink14Description: https://datasheet.octopart.com:443/RC0805FR-07470RL-Yageo-datasheet-118657.pdf?src-supplier=DigiKey; ComponentLink15URL: https://datasheet.octopart.com:443/RC0805FR-07470RL-Yageo-datasheet-502840.pdf?src-supplier=element14; ComponentLink15Description: https://datasheet.octopart.com:443/RC0805FR-07470RL-Yageo-datasheet-502840.pdf?src-supplier=element14; ComponentLink16URL: http://sigma.octopart.com:80/conflict_mineral_statement/Yageo-company-3.pdf?src-supplier=Compliance+Statements; ComponentLink16Description: http://sigma.octopart.com:80/conflict_mineral_statement/Yageo-company-3.pdf?src-supplier=Compliance+Statements; ComponentLink17URL: http://sigma.octopart.com:80/rohs_statement/Yageo-company-2.pdf?src-supplier=Compliance+Statements; ComponentLink17Description: http://sigma.octopart.com:80/rohs_statement/Yageo-company-2.pdf?src-supplier=Compliance+Statements
TP1-TP17 = 5004: PCB TEST POINT; Manufacturer: Keystone; Number Of Contacts: 1; Is Female: yes; Device Class L1: Connectors; Manufacturer Part Number: 5004; Digikey Description: PC TEST POINT MINIATURE YELLOW; ComponentLink2URL: https://www.keyelco.com/product-pdf.cfm?p=1313; Lead Free: Yes; ComponentLink2Description: Datasheet; Category: Conn; Height: 4.72mm; Octopart: https://octopart.com/5004-keystone-28591; Mouser Description: TEST POINT PC MINI .040"D YELLOW; Device Class L3: unset; Contact Material: Silver; Package: 5004; Automotive: No; Device Class L2: unset; RoHS: TRUE; LCSC Part Number: C2906762
U1 U2 U4 U5 U17 U18 = SI2301CDS-T1-GE3: MOSFET P-CH 20V 3.1A SOT23-3; Manufacturer_Name: Vishay; Copyright: Copyright (C) 2026 Ultra Librarian. All rights reserved.; Manufacturer_Part_Number: SI2301CDS-T1-GE3; RefDes: RefDes; Type: Type; LCSC Part Number: C10487
U3 = IRM-05-5: AC/DC CONVERTER 5V 5W; Manufacturer: Mean Well; Approvals: CB, CE, IEC, TUV, UL; Current - Output 1: 1A; Efficiency: 71%; Max Supply Voltage: 305V; Max Output Voltage: 5.125V; Min Input Voltage: 85V; Min Output Voltage: 4.875V; Nominal Supply Voltage: 115V; Number of Circuits: 1; Supplier: Arrow Electronics; Supplier Part Number: IRM-05-5; Manufacturer Part Number: IRM-05-5; RoHS: Compliant; Category: Power Supply Modules; Stock: 18160; Pricing: 1=7.467, 20=7.35, 50=7.162 (USD); Composition: Hybrid; Export Control Classification Number (ECCN) Code: EAR99; Height: 21.5mm; Height - Seated (Max): 21.5mm; Introduction Date: 2013-07-05; Lead Free: Lead Free; Length: 45.7mm; Lifecycle Status: Production; Max Operating Temperature: 70°C; Max Output current: 1A; Max Output Power: 5W; Max Power Dissipation: 5W; Min Operating Temperature: -30°C; Min Supply Voltage: 85V; Mounting Technology: PCB, Through Hole; Nominal Output Voltage: 5V; Number of Outputs: 1; Pins: 4; Number of Terminals: 4; Output Current: 1A; Output Power: 5W; Output Voltage: 5V; REACH SVHC: Unaffected; Voltage - Output 1: 5V; Weight: 39.999986g; Width: 25.4mm; ComponentLink1URL: https://datasheet.octopart.com:443/IRM-05-5-Mean-Well-datasheet-180626755.pdf?src-supplier=IHS; ComponentLink1Description: https://datasheet.octopart.com:443/IRM-05-5-Mean-Well-datasheet-180626755.pdf?src-supplier=IHS; ComponentLink2URL: https://datasheet.octopart.com:443/IRM-05-5-Mean-Well-datasheet-101610177.pdf?src-supplier=Farnell; ComponentLink2Description: https://datasheet.octopart.com:443/IRM-05-5-Mean-Well-datasheet-101610177.pdf?src-supplier=Farnell; ComponentLink3URL: https://datasheet.octopart.com:443/IRM-05-5-Mean-Well-datasheet-67333141.pdf?src-supplier=Sager+Power+Systems; ComponentLink3Description: https://datasheet.octopart.com:443/IRM-05-5-Mean-Well-datasheet-67333141.pdf?src-supplier=Sager+Power+Systems; ComponentLink4URL: https://datasheet.octopart.com:443/IRM-05-5-Mean-Well-datasheet-154740696.pdf?src-supplier=Master+Electronics; ComponentLink4Description: https://datasheet.octopart.com:443/IRM-05-5-Mean-Well-datasheet-154740696.pdf?src-supplier=Master+Electronics; ComponentLink5URL: https://datasheet.octopart.com:443/IRM-05-5-Mean-Well-datasheet-34148673.pdf?src-supplier=Future+Electronics; ComponentLink5Description: https://datasheet.octopart.com:443/IRM-05-5-Mean-Well-datasheet-34148673.pdf?src-supplier=Future+Electronics; ComponentLink6URL: https://datasheet.octopart.com:443/IRM-05-5-Mean-Well-datasheet-27625340.pdf?src-supplier=Jameco+(USA); ComponentLink6Description: https://datasheet.octopart.com:443/IRM-05-5-Mean-Well-datasheet-27625340.pdf?src-supplier=Jameco+(USA); ComponentLink7URL: https://datasheet.octopart.com:443/IRM-05-5-Mean-Well-datasheet-19208722.pdf?src-supplier=Telerex+Europe; ComponentLink7Description: https://datasheet.octopart.com:443/IRM-05-5-Mean-Well-datasheet-19208722.pdf?src-supplier=Telerex+Europe; ComponentLink8URL: https://datasheet.octopart.com:443/IRM-05-5-Mean-Well-datasheet-194193599.pdf?src-supplier=LCSC; ComponentLink8Description: https://datasheet.octopart.com:443/IRM-05-5-Mean-Well-datasheet-194193599.pdf?src-supplier=LCSC; ComponentLink9URL: https://datasheet.octopart.com:443/IRM-05-5-Mean-Well-datasheet-158921293.pdf?src-supplier=Component+Distributors+Inc.; ComponentLink9Description: https://datasheet.octopart.com:443/IRM-05-5-Mean-Well-datasheet-158921293.pdf?src-supplier=Component+Distributors+Inc.; ComponentLink10URL: https://datasheet.octopart.com:443/IRM-05-5-Mean-Well-datasheet-137204475.pdf?src-supplier=Component+Distributors+Inc.; ComponentLink10Description: https://datasheet.octopart.com:443/IRM-05-5-Mean-Well-datasheet-137204475.pdf?src-supplier=Component+Distributors+Inc.; ComponentLink11URL: https://datasheet.octopart.com:443/IRM-05-5-Mean-Well-datasheet-151511263.pdf?src-supplier=TME; ComponentLink11Description: https://datasheet.octopart.com:443/IRM-05-5-Mean-Well-datasheet-151511263.pdf?src-supplier=TME; ComponentLink12URL: https://datasheet.octopart.com:443/IRM-05-5-Mean-Well-datasheet-151511270.pdf?src-supplier=TME; ComponentLink12Description: https://datasheet.octopart.com:443/IRM-05-5-Mean-Well-datasheet-151511270.pdf?src-supplier=TME; ComponentLink13URL: https://datasheet.octopart.com:443/IRM-05-5-Mean-Well-datasheet-83579035.pdf?src-supplier=TME; ComponentLink13Description: https://datasheet.octopart.com:443/IRM-05-5-Mean-Well-datasheet-83579035.pdf?src-supplier=TME; ComponentLink14URL: https://datasheet.octopart.com:443/IRM-05-5-Mean-Well-datasheet-24998212.pdf?src-supplier=TME; ComponentLink14Description: https://datasheet.octopart.com:443/IRM-05-5-Mean-Well-datasheet-24998212.pdf?src-supplier=TME; ComponentLink15URL: https://datasheet.octopart.com:443/IRM-05-5-Mean-Well-datasheet-140567947.pdf?src-supplier=Arrow.cn; ComponentLink15Description: https://datasheet.octopart.com:443/IRM-05-5-Mean-Well-datasheet-140567947.pdf?src-supplier=Arrow.cn; LCSC Part Number: C48603696
U6 = LT1763IS8-5#PBF: IC REG LINEAR 5V 500MA 8-SO; Manufacturer: Analog Devices; Manufacturer Lifecycle Status: PRODUCTION; Dropout Voltage: 300mV; Max Supply Voltage: 20V; Min Current Limit: 520mA; Min Input Voltage: 1.8V; Number of Outputs: 1; Operating Supply Current: 30µA; Output Type: Fixed; Polarity: Positive; Power Supply Rejection Ratio (PSRR): 65dB; Supplier: Arrow Electronics; Supplier Part Number: LT1763IS8-5#PBF; Manufacturer Part Number: LT1763IS8-5#PBF; RoHS: Compliant; Category: LDO Voltage Regulators; Stock: 119; Pricing: 1=7.815, 10=5.751, 25=5.694, 100=5.072 (USD); Lifecycle Status: Production; Max Operating Temperature: 125°C; Min Operating Temperature: -40°C; Nominal Output Voltage: 5V; Pins: 8; Number of Regulators: 1; Output Current: 500mA; Output Voltage: 5V; REACH SVHC: Unaffected; Schedule B: 8542390000, 8542390000|8542390000|8542390000|8542390000|8542390000|8542390000|8542390000|8542390000|8542390000|8542390000|8542390000|8542390000|8542390000|8542390000|8542390000|8542390000|8542390000|8542390000|8542390000|8542390000|8542390000|8542390000|8542390000|85; ComponentLink1URL: https://octopart.com:443/opatz8j6/c1?t=Ebpcw7CmPQtKNRnGwzCsB8Km5QI9SJKjuQjJH0aKtBETBPytFrpjDY6oFgIq1hiQXU_Ry5HVNKnDBr9_yr5U1VD3FTwTD8YC5rP2o44Ab-hGVQM7czKy67lcZ3cEKdPmXMg_Z_cGbSh3vKzdLA1h_IU9v3WoVfL7cJSuIKmWmZ6Fprabk8AzFbd_zlTnU_mZmTTWMhcBBAtpUXbuQYrFbJG3wspjmbLLERIatjPVcqSkkM_MuCcFPHZJZUl04vK-K-3Q5sidJHL7KRZw34vc0DdA8yiHVpnaAIuodgrAzMkxjVJPvC5okA&src-supplier=Analog+Devices; ComponentLink1Description: https://octopart.com:443/opatz8j6/c1?t=Ebpcw7CmPQtKNRnGwzCsB8Km5QI9SJKjuQjJH0aKtBETBPytFrpjDY6oFgIq1hiQXU_Ry5HVNKnDBr9_yr5U1VD3FTwTD8YC5rP2o44Ab-hGVQM7czKy67lcZ3cEKdPmXMg_Z_cGbSh3vKzdLA1h_IU9v3WoVfL7cJSuIKmWmZ6Fprabk8AzFbd_zlTnU_mZmTTWMhcBBAtpUXbuQYrFbJG3wspjmbLLERIatjPVcqSkkM_MuCcFPHZJZUl04vK-K-3Q5sidJHL7KRZw34vc0DdA8yiHVpnaAIuodgrAzMkxjVJPvC5okA&src-supplier=Analog+Devices; ComponentLink2URL: https://datasheet.octopart.com:443/LT1763IS8-5%23PBF-Linear-Technology-datasheet-10687378.pdf?src-supplier=Upverter; ComponentLink2Description: https://datasheet.octopart.com:443/LT1763IS8-5%23PBF-Linear-Technology-datasheet-10687378.pdf?src-supplier=Upverter; ComponentLink3URL: https://datasheet.octopart.com:443/LT1763IS8-5%23PBF-Analog-Devices-datasheet-34225385.pdf?src-supplier=element14+APAC; ComponentLink3Description: https://datasheet.octopart.com:443/LT1763IS8-5%23PBF-Analog-Devices-datasheet-34225385.pdf?src-supplier=element14+APAC; ComponentLink4URL: https://datasheet.octopart.com:443/LT1763IS8-5%23PBF-Linear-Technology-datasheet-8700792.pdf?src-supplier=Farnell; ComponentLink4Description: https://datasheet.octopart.com:443/LT1763IS8-5%23PBF-Linear-Technology-datasheet-8700792.pdf?src-supplier=Farnell; ComponentLink5URL: https://sigma.octopart.com:443/57689574/technical_drawing/Linear-Technology-LT1763IS8-5%23PBF.pdf?src-supplier=Linear+Technology; ComponentLink5Description: https://sigma.octopart.com:443/57689574/technical_drawing/Linear-Technology-LT1763IS8-5%23PBF.pdf?src-supplier=Linear+Technology; ComponentLink6URL: https://datasheet.octopart.com:443/LT1763IS8-5%23PBF-Linear-Technology-datasheet-503827.pdf?src-supplier=Component+Distributors+Inc.; ComponentLink6Description: https://datasheet.octopart.com:443/LT1763IS8-5%23PBF-Linear-Technology-datasheet-503827.pdf?src-supplier=Component+Distributors+Inc.; ComponentLink7URL: http://sigma.octopart.com:80/conflict_mineral_statement/Analog-Devices-company-33.pdf?src-supplier=Compliance+Statements; ComponentLink7Description: http://sigma.octopart.com:80/conflict_mineral_statement/Analog-Devices-company-33.pdf?src-supplier=Compliance+Statements; ComponentLink8URL: https://octopart.com:443/opatz8j6/c1?t=kVQKxYRg13CYfxrdy69KyFd_rl0hY_LDqWrQ1YyOKtTyuOMylFgcnP0bVUf3GNrw39o-SRsGyQXIdnmWtO9oyzBU0EuAiBa8NCdTUj49_csqsGjvb8cZ9nRchLctyLtWi99s3K5VC9WM2qNU-bZvQtidgMGLK4xXjXMUZ0FmF3SNi_KWH-PQucqQoFGvz1WqkLsK056S5i-IR1Z8uIKtKSojWwisOZKXV74ikTz1ClZZY-pb3NQiLtvP1d0Ba0e-hiuaWQXP8NV9QpynSvhLpLEizviPxLHwFDE0Ky8Efs26IPoaZupI1Q&src-supplier=Compliance+Statements; ComponentLink8Description: https://octopart.com:443/opatz8j6/c1?t=kVQKxYRg13CYfxrdy69KyFd_rl0hY_LDqWrQ1YyOKtTyuOMylFgcnP0bVUf3GNrw39o-SRsGyQXIdnmWtO9oyzBU0EuAiBa8NCdTUj49_csqsGjvb8cZ9nRchLctyLtWi99s3K5VC9WM2qNU-bZvQtidgMGLK4xXjXMUZ0FmF3SNi_KWH-PQucqQoFGvz1WqkLsK056S5i-IR1Z8uIKtKSojWwisOZKXV74ikTz1ClZZY-pb3NQiLtvP1d0Ba0e-hiuaWQXP8NV9QpynSvhLpLEizviPxLHwFDE0Ky8Efs26IPoaZupI1Q&src-supplier=Compliance+Statements; LCSC Part Number: C190921
U7-U10 U16 = TLV9062IDR: IC OP AMP 2CH 8-SOIC; Slew Rate: 6.5V/µs; Number of Channels: 2; Input Offset Voltage (Vos): 300uV; Input Bias Current: 0.5pA; Output Current per Channel: 50mA; Gain Bandwidth Product: 10MHz; Operating Supply Current: 538uA; RoHS Compliant: Yes; Case/Package: SOIC; Number of Circuits: 2; Number of Pins: 8; Mount: Surface Mount; Max Operating Temperature: 125°C; Min Operating Temperature: -40°C; Packaging: Tape and Reel; LCSC Part Number: C398355
U11 = 74HC86D,653: IC XOR 4-CIR 2-IN 14-SOIC; Manufacturer: Nexperia; Manufacturer Lifecycle Status: RELEASED FOR SUPPLY; High Level Output Current: -5.2mA; Load Capacitance: 50pF; Logic Function: OR, XOR; Low Level Output Current: 4mA; Max Supply Voltage: 6V; Min Supply Voltage: 2V; Nominal Supply Voltage (DC): 5V; Number of Circuits: 4; Number of Input Lines: 8; Number of Inputs: 2; Number of Outputs: 1; Output Current: 5.2mA; Propagation Delay: 36ns; Quiescent Current: 2µA; Schmitt Trigger Input: No; Supplier: Future Electronics; Supplier Part Number: 74HC86D,653; Manufacturer Part Number: 74HC86D,653; RoHS: Compliant; Category: Logic Gates; Stock: 27500; Pricing: 2500=0.116, 5000=0.115, 10000=0.113, 37500=0.11 (USD); Case/Package: SOP; China RoHS: Compliant; Contact Plating: Gold; Country of Origin: Mainland China, Thailand; Export Control Classification Number (ECCN) Code: EAR99; Height - Seated (Max): 1.75mm; Harmonized Tariff Schedule (HTS) Code: 8542.39.00.01; Introduction Date: 1990-12-01; Lead Free: Lead Free; Length: 8.65mm; Lifecycle Status: Production; Max Operating Temperature: 125°C; Min Operating Temperature: -40°C; Mounting Technology: Surface Mount; Number of Elements: 4; Number of Gates: 4; Number of Output Lines: 4; Pins: 14; Number of Terminals: 14; Operating Supply Voltage: 5V; Radiation Hardening: No; REACH SVHC: Unaffected; Schedule B: 8542390000, 8542390000|8542390000|8542390000|8542390000|8542390000; Temperature Grade: Automotive; Terminal Pitch: 1.27mm; Turn-On Delay Time: 36ns; Width: 3.9mm; ComponentLink1URL: https://datasheet.octopart.com:443/74HC86D%2C653-Nexperia-datasheet-87580431.pdf?src-supplier=Augswan; ComponentLink1Description: https://datasheet.octopart.com:443/74HC86D%2C653-Nexperia-datasheet-87580431.pdf?src-supplier=Augswan; ComponentLink2URL: https://datasheet.octopart.com:443/74HC86D%2C653-Nexperia-datasheet-61648451.pdf?src-supplier=IHS; ComponentLink2Description: https://datasheet.octopart.com:443/74HC86D%2C653-Nexperia-datasheet-61648451.pdf?src-supplier=IHS; ComponentLink3URL: https://datasheet.octopart.com:443/74HC86D%2C653-Nexperia-datasheet-140812836.pdf?src-supplier=IHS; ComponentLink3Description: https://datasheet.octopart.com:443/74HC86D%2C653-Nexperia-datasheet-140812836.pdf?src-supplier=IHS; ComponentLink4URL: https://datasheet.octopart.com:443/74HC86D%2C653-Philips-datasheet-12513527.pdf?src-supplier=element14+APAC; ComponentLink4Description: https://datasheet.octopart.com:443/74HC86D%2C653-Philips-datasheet-12513527.pdf?src-supplier=element14+APAC; ComponentLink5URL: https://datasheet.octopart.com:443/74HC86D%2C653-NXP-datasheet-19589.pdf?src-supplier=Arrow+Electronics; ComponentLink5Description: https://datasheet.octopart.com:443/74HC86D%2C653-NXP-datasheet-19589.pdf?src-supplier=Arrow+Electronics; ComponentLink6URL: https://datasheet.octopart.com:443/74HC86D%2C653-Nexperia-datasheet-160667643.pdf?src-supplier=SHENGYU+ELECTRONICS; ComponentLink6Description: https://datasheet.octopart.com:443/74HC86D%2C653-Nexperia-datasheet-160667643.pdf?src-supplier=SHENGYU+ELECTRONICS; ComponentLink7URL: https://datasheet.octopart.com:443/74HC86D%2C653-NXP-Semiconductors-datasheet-17720673.pdf?src-supplier=Jameco+(USA); ComponentLink7Description: https://datasheet.octopart.com:443/74HC86D%2C653-NXP-Semiconductors-datasheet-17720673.pdf?src-supplier=Jameco+(USA); ComponentLink8URL: http://sigma.octopart.com:80/reach_statement/NXP-Semiconductors-company-13.pdf?src-supplier=Compliance+Statements; ComponentLink8Description: http://sigma.octopart.com:80/reach_statement/NXP-Semiconductors-company-13.pdf?src-supplier=Compliance+Statements; ComponentLink9URL: http://sigma.octopart.com:80/rohs_statement/NXP-Semiconductors-company-12.pdf?src-supplier=Compliance+Statements; ComponentLink9Description: http://sigma.octopart.com:80/rohs_statement/NXP-Semiconductors-company-12.pdf?src-supplier=Compliance+Statements; LCSC Part Number: C5955